# EAGLE schematic attenuverter3 (EAGLE 7.5.0)
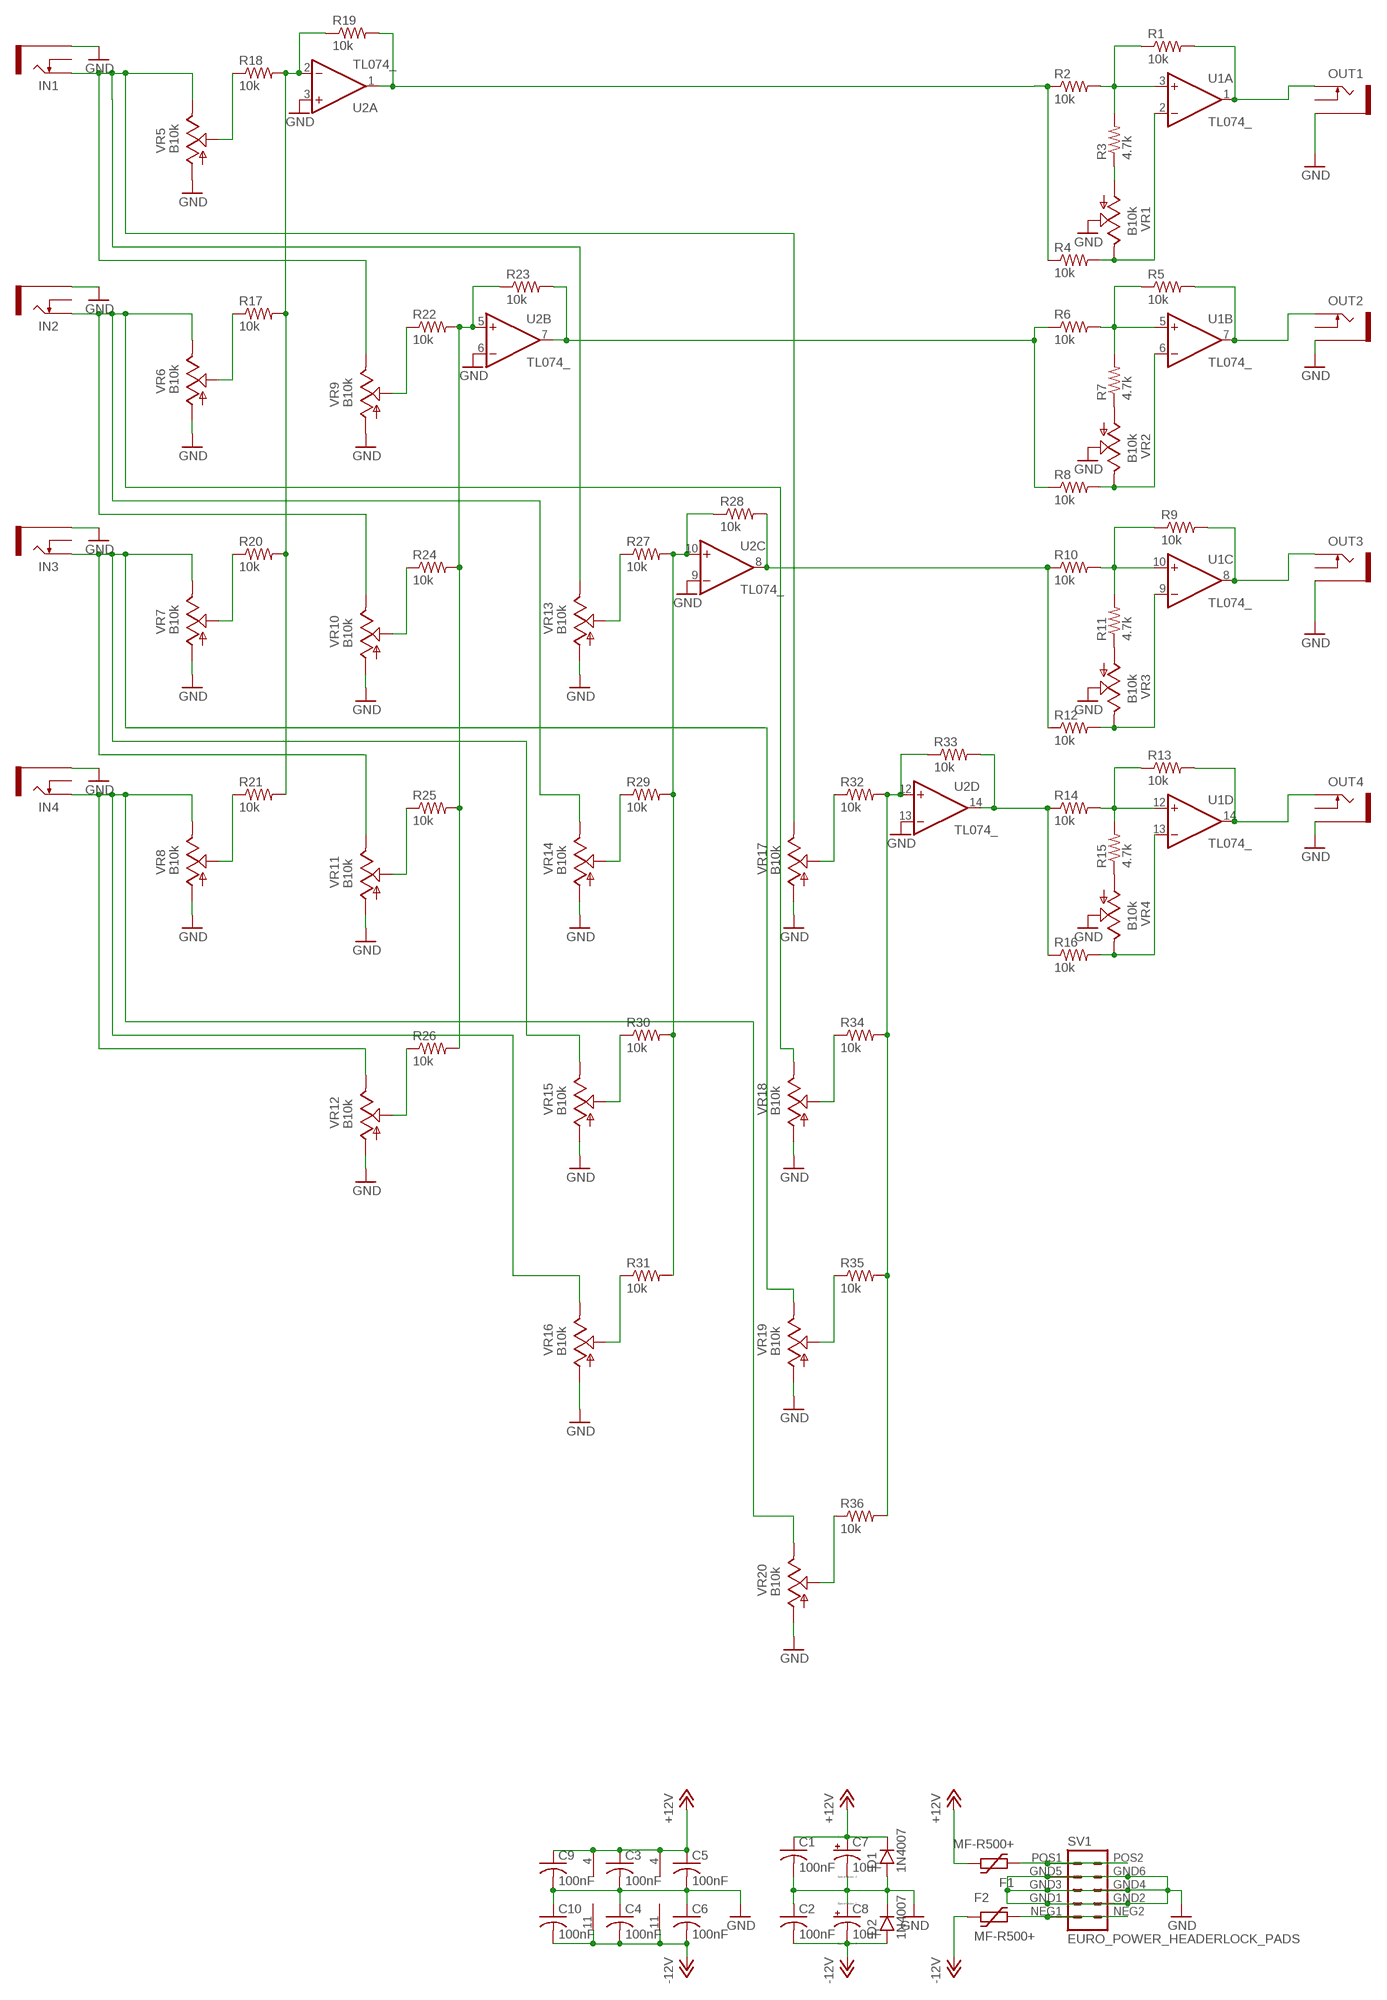
[diagram p0: schematic, sheet 1]

## Parts
C1  100nF  C-US050-055X075  [C050-055X075]
C2  100nF  C-US050-055X075  [C050-055X075]
C3  100nF  C-US050-055X075  [C050-055X075]
C4  100nF  C-US050-055X075  [C050-055X075]
C5  100nF  C-US050-055X075  [C050-055X075]
C6  100nF  C-US050-055X075  [C050-055X075]
C7  10uF  CPOL-USE2.5-6  [E2,5-6]
C8  10uF  CPOL-USE2.5-6  [E2,5-6]
C9  100nF  C-US050-055X075  [C050-055X075]
C10  100nF  C-US050-055X075  [C050-055X075]
D1  1N4007  1N400X.4  [DO41-4]
D2  1N4007  1N400X.4  [DO41-4]
F1  MF-R500+  [BOURNS-MF-R]
F2  MF-R500+  [BOURNS-MF-R]
IN1  THONKICONNNEW  [WQP-PJ301M-12_JACK]
IN2  THONKICONNNEW  [WQP-PJ301M-12_JACK]
IN3  THONKICONNNEW  [WQP-PJ301M-12_JACK]
IN4  THONKICONNNEW  [WQP-PJ301M-12_JACK]
OUT1  THONKICONNNEW  [WQP-PJ301M-12_JACK]
OUT2  THONKICONNNEW  [WQP-PJ301M-12_JACK]
OUT3  THONKICONNNEW  [WQP-PJ301M-12_JACK]
OUT4  THONKICONNNEW  [WQP-PJ301M-12_JACK]
R1  10k  R-US_0207/7  [0207/7]
R2  10k  R-US_0207/7  [0207/7]
R3  4.7k  R-US_0207/7  [0207/7]
R4  10k  R-US_0207/7  [0207/7]
R5  10k  R-US_0207/7  [0207/7]
R6  10k  R-US_0207/7  [0207/7]
R7  4.7k  R-US_0207/7  [0207/7]
R8  10k  R-US_0207/7  [0207/7]
R9  10k  R-US_0207/7  [0207/7]
R10  10k  R-US_0207/7  [0207/7]
R11  4.7k  R-US_0207/7  [0207/7]
R12  10k  R-US_0207/7  [0207/7]
R13  10k  R-US_0207/7  [0207/7]
R14  10k  R-US_0207/7  [0207/7]
R15  4.7k  R-US_0207/7  [0207/7]
R16  10k  R-US_0207/7  [0207/7]
R17  10k  R-US_0207/7  [0207/7]
R18  10k  R-US_0207/7  [0207/7]
R19  10k  R-US_0207/7  [0207/7]
R20  10k  R-US_0207/7  [0207/7]
R21  10k  R-US_0207/7  [0207/7]
R22  10k  R-US_0207/7  [0207/7]
R23  10k  R-US_0207/7  [0207/7]
R24  10k  R-US_0207/7  [0207/7]
R25  10k  R-US_0207/7  [0207/7]
R26  10k  R-US_0207/7  [0207/7]
R27  10k  R-US_0207/7  [0207/7]
R28  10k  R-US_0207/7  [0207/7]
R29  10k  R-US_0207/7  [0207/7]
R30  10k  R-US_0207/7  [0207/7]
R31  10k  R-US_0207/7  [0207/7]
R32  10k  R-US_0207/7  [0207/7]
R33  10k  R-US_0207/7  [0207/7]
R34  10k  R-US_0207/7  [0207/7]
R35  10k  R-US_0207/7  [0207/7]
R36  10k  R-US_0207/7  [0207/7]
SV1  EURO_POWER_HEADERLOCK_PADS  [EURO_PWR_HEADER_LOCK]
U1  TL074_  [DIL14]
U2  TL074_  [DIL14]
VR1  B10k  9MM_SNAP-IN_POT_  [9MM_SNAP-IN_POT]
VR2  B10k  9MM_SNAP-IN_POT_  [9MM_SNAP-IN_POT]
VR3  B10k  9MM_SNAP-IN_POT_  [9MM_SNAP-IN_POT]
VR4  B10k  9MM_SNAP-IN_POT_  [9MM_SNAP-IN_POT]
VR5  B10k  9MM_SNAP-IN_POT_  [9MM_SNAP-IN_POT]
VR6  B10k  9MM_SNAP-IN_POT_  [9MM_SNAP-IN_POT]
VR7  B10k  9MM_SNAP-IN_POT_  [9MM_SNAP-IN_POT]
VR8  B10k  9MM_SNAP-IN_POT_  [9MM_SNAP-IN_POT]
VR9  B10k  9MM_SNAP-IN_POT_  [9MM_SNAP-IN_POT]
VR10  B10k  9MM_SNAP-IN_POT_  [9MM_SNAP-IN_POT]
VR11  B10k  9MM_SNAP-IN_POT_  [9MM_SNAP-IN_POT]
VR12  B10k  9MM_SNAP-IN_POT_  [9MM_SNAP-IN_POT]
VR13  B10k  9MM_SNAP-IN_POT_  [9MM_SNAP-IN_POT]
VR14  B10k  9MM_SNAP-IN_POT_  [9MM_SNAP-IN_POT]
VR15  B10k  9MM_SNAP-IN_POT_  [9MM_SNAP-IN_POT]
VR16  B10k  9MM_SNAP-IN_POT_  [9MM_SNAP-IN_POT]
VR17  B10k  9MM_SNAP-IN_POT_  [9MM_SNAP-IN_POT]
VR18  B10k  9MM_SNAP-IN_POT_  [9MM_SNAP-IN_POT]
VR19  B10k  9MM_SNAP-IN_POT_  [9MM_SNAP-IN_POT]
VR20  B10k  9MM_SNAP-IN_POT_  [9MM_SNAP-IN_POT]

## Nets
+12V: C1.1 C3.1 C5.1 C7.+ C9.1 D1.C F1.P$2 U1.4(P:V+) U2.4(P:V+)
-12V: C2.2 C4.2 C6.2 C8.- C10.2 D2.A F2.P$1 U1.11(P:V-) U2.11(P:V-)
GND: C1.2 C2.1 C3.2 C4.1 C5.2 C6.1 C7.- C8.+ C9.2 C10.1 D1.A D2.C IN1.P$3_SLEEVE(SLEEVE) IN2.P$3_SLEEVE(SLEEVE) IN3.P$3_SLEEVE(SLEEVE) IN4.P$3_SLEEVE(SLEEVE) OUT1.P$3_SLEEVE(SLEEVE) OUT2.P$3_SLEEVE(SLEEVE) OUT3.P$3_SLEEVE(SLEEVE) OUT4.P$3_SLEEVE(SLEEVE) SV1.GND1 SV1.GND2 SV1.GND3 SV1.GND4 SV1.GND5 SV1.GND6 U2.3(A:+IN) U2.6(B:-IN) U2.9(C:-IN) U2.13(D:-IN) VR1.2(S) VR2.2(S) VR3.2(S) VR4.2(S) VR5.1(A) VR6.1(A) VR7.1(A) VR8.1(A) VR9.1(A) VR10.1(A) VR11.1(A) VR12.1(A) VR13.1(A) VR14.1(A) VR15.1(A) VR16.1(A) VR17.1(A) VR18.1(A) VR19.1(A) VR20.1(A)
N$1: R1.1 R2.2 R3.2 U1.3(A:+IN)
N$2: R2.1 R4.1 R19.2 U2.1(A:OUT)
N$3: R4.2 U1.2(A:-IN) VR1.3(E)
N$4: R3.1 VR1.1(A)
N$5: R22.2 R23.1 R24.2 R25.2 R26.2 U2.5(B:+IN)
N$6: R5.1 R6.2 R7.2 U1.5(B:+IN)
N$7: OUT1.P$1_TIP(TIP) R1.2 U1.1(A:OUT)
N$8: R8.2 U1.6(B:-IN) VR2.3(E)
N$9: F1.P$1 SV1.POS1 SV1.POS2
N$10: F2.P$2 SV1.NEG1 SV1.NEG2
N$11: R7.1 VR2.1(A)
N$12: OUT2.P$1_TIP(TIP) R5.2 U1.7(B:OUT)
N$13: R22.1 VR9.2(S)
N$14: R9.1 R10.2 R11.2 U1.10(C:+IN)
N$15: R12.2 U1.9(C:-IN) VR3.3(E)
N$16: R11.1 VR3.1(A)
N$17: OUT3.P$1_TIP(TIP) R9.2 U1.8(C:OUT)
N$18: IN4.P$1_TIP(TIP) VR8.3(E) VR12.3(E) VR16.3(E) VR20.3(E)
N$19: R13.1 R14.2 R15.2 U1.12(D:+IN)
N$20: R16.2 U1.13(D:-IN) VR4.3(E)
N$21: R15.1 VR4.1(A)
N$22: OUT4.P$1_TIP(TIP) R13.2 U1.14(D:OUT)
N$23: IN2.P$1_TIP(TIP) VR6.3(E) VR10.3(E) VR14.3(E) VR18.3(E)
N$24: R17.2 R18.2 R19.1 R20.2 R21.2 U2.2(A:-IN)
N$26: R18.1 VR5.2(S)
N$27: R17.1 VR6.2(S)
N$28: IN3.P$1_TIP(TIP) VR7.3(E) VR11.3(E) VR15.3(E) VR19.3(E)
N$29: R20.1 VR7.2(S)
N$31: R21.1 VR8.2(S)
N$32: R24.1 VR10.2(S)
N$34: R25.1 VR11.2(S)
N$36: R26.1 VR12.2(S)
N$38: IN1.P$1_TIP(TIP) VR5.3(E) VR9.3(E) VR13.3(E) VR17.3(E)
N$39: R6.1 R8.1 R23.2 U2.7(B:OUT)
N$40: R27.2 R28.1 R29.2 R30.2 R31.2 U2.10(C:+IN)
N$41: R27.1 VR13.2(S)
N$43: R29.1 VR14.2(S)
N$45: R30.1 VR15.2(S)
N$47: R31.1 VR16.2(S)
N$48: R10.1 R12.1 R28.2 U2.8(C:OUT)
N$49: R32.2 R33.1 R34.2 R35.2 R36.2 U2.12(D:+IN)
N$50: R32.1 VR17.2(S)
N$52: R34.1 VR18.2(S)
N$54: R35.1 VR19.2(S)
N$56: R36.1 VR20.2(S)
N$57: R14.1 R16.1 R33.2 U2.14(D:OUT)
Unconnected: IN1.P$2_SWITCH(SWITCH) IN2.P$2_SWITCH(SWITCH) IN3.P$2_SWITCH(SWITCH) IN4.P$2_SWITCH(SWITCH) OUT1.P$2_SWITCH(SWITCH) OUT2.P$2_SWITCH(SWITCH) OUT3.P$2_SWITCH(SWITCH) OUT4.P$2_SWITCH(SWITCH)

## Library data of the parts
C1-C6 C9 C10 = resistor:C-US: CAPACITOR, American symbol
C7 C8 = resistor:CPOL-US: POLARIZED CAPACITOR, American symbol
D1 D2 = gm-diodes:1N400X: Rectifier Diodes often used in power supply to prevent damage from reverse polarization
F1 F2 = ptc-littlefuse:MF-R500+: http://www.farnell.com/datasheets/1817521.pdf
IN1-IN4 OUT1-OUT4 = MusicThingModular:THONKICONN: 3.5mm socket for Eurorack modular synths
R1-R36 = resistor:R-US_: RESISTOR, American symbol
SV1 = MusicThingModular:EURO_POWER_HEADER: Power Header 10 pin power header for Eurorack Power Supplies Variants with fatter pads for easier soldering, and the LOCK variant which has 5mil offset pins to hold the component in place before soldering
U1 U2 = MusicThingModular:TL074: Generic Quad Op Amp
VR1-VR20 = MusicThingModular:9MM_SNAP-IN_POT: 9mm vertical snap-in pot, Alpha / Panasonic style